# EasyEDA Pro project ProPrj_control-acceso-rfid_2025-05-21.epro

# Schematic Schematic1
Board Name: Board1; Create Date: 2025-05-10; Page Name: P1; Project Name: PUERTA; Schematic Name: Schematic1; Update Date: 2025-05-12; Company: EasyEDA.com; Page Size: A4; Version: V1.0
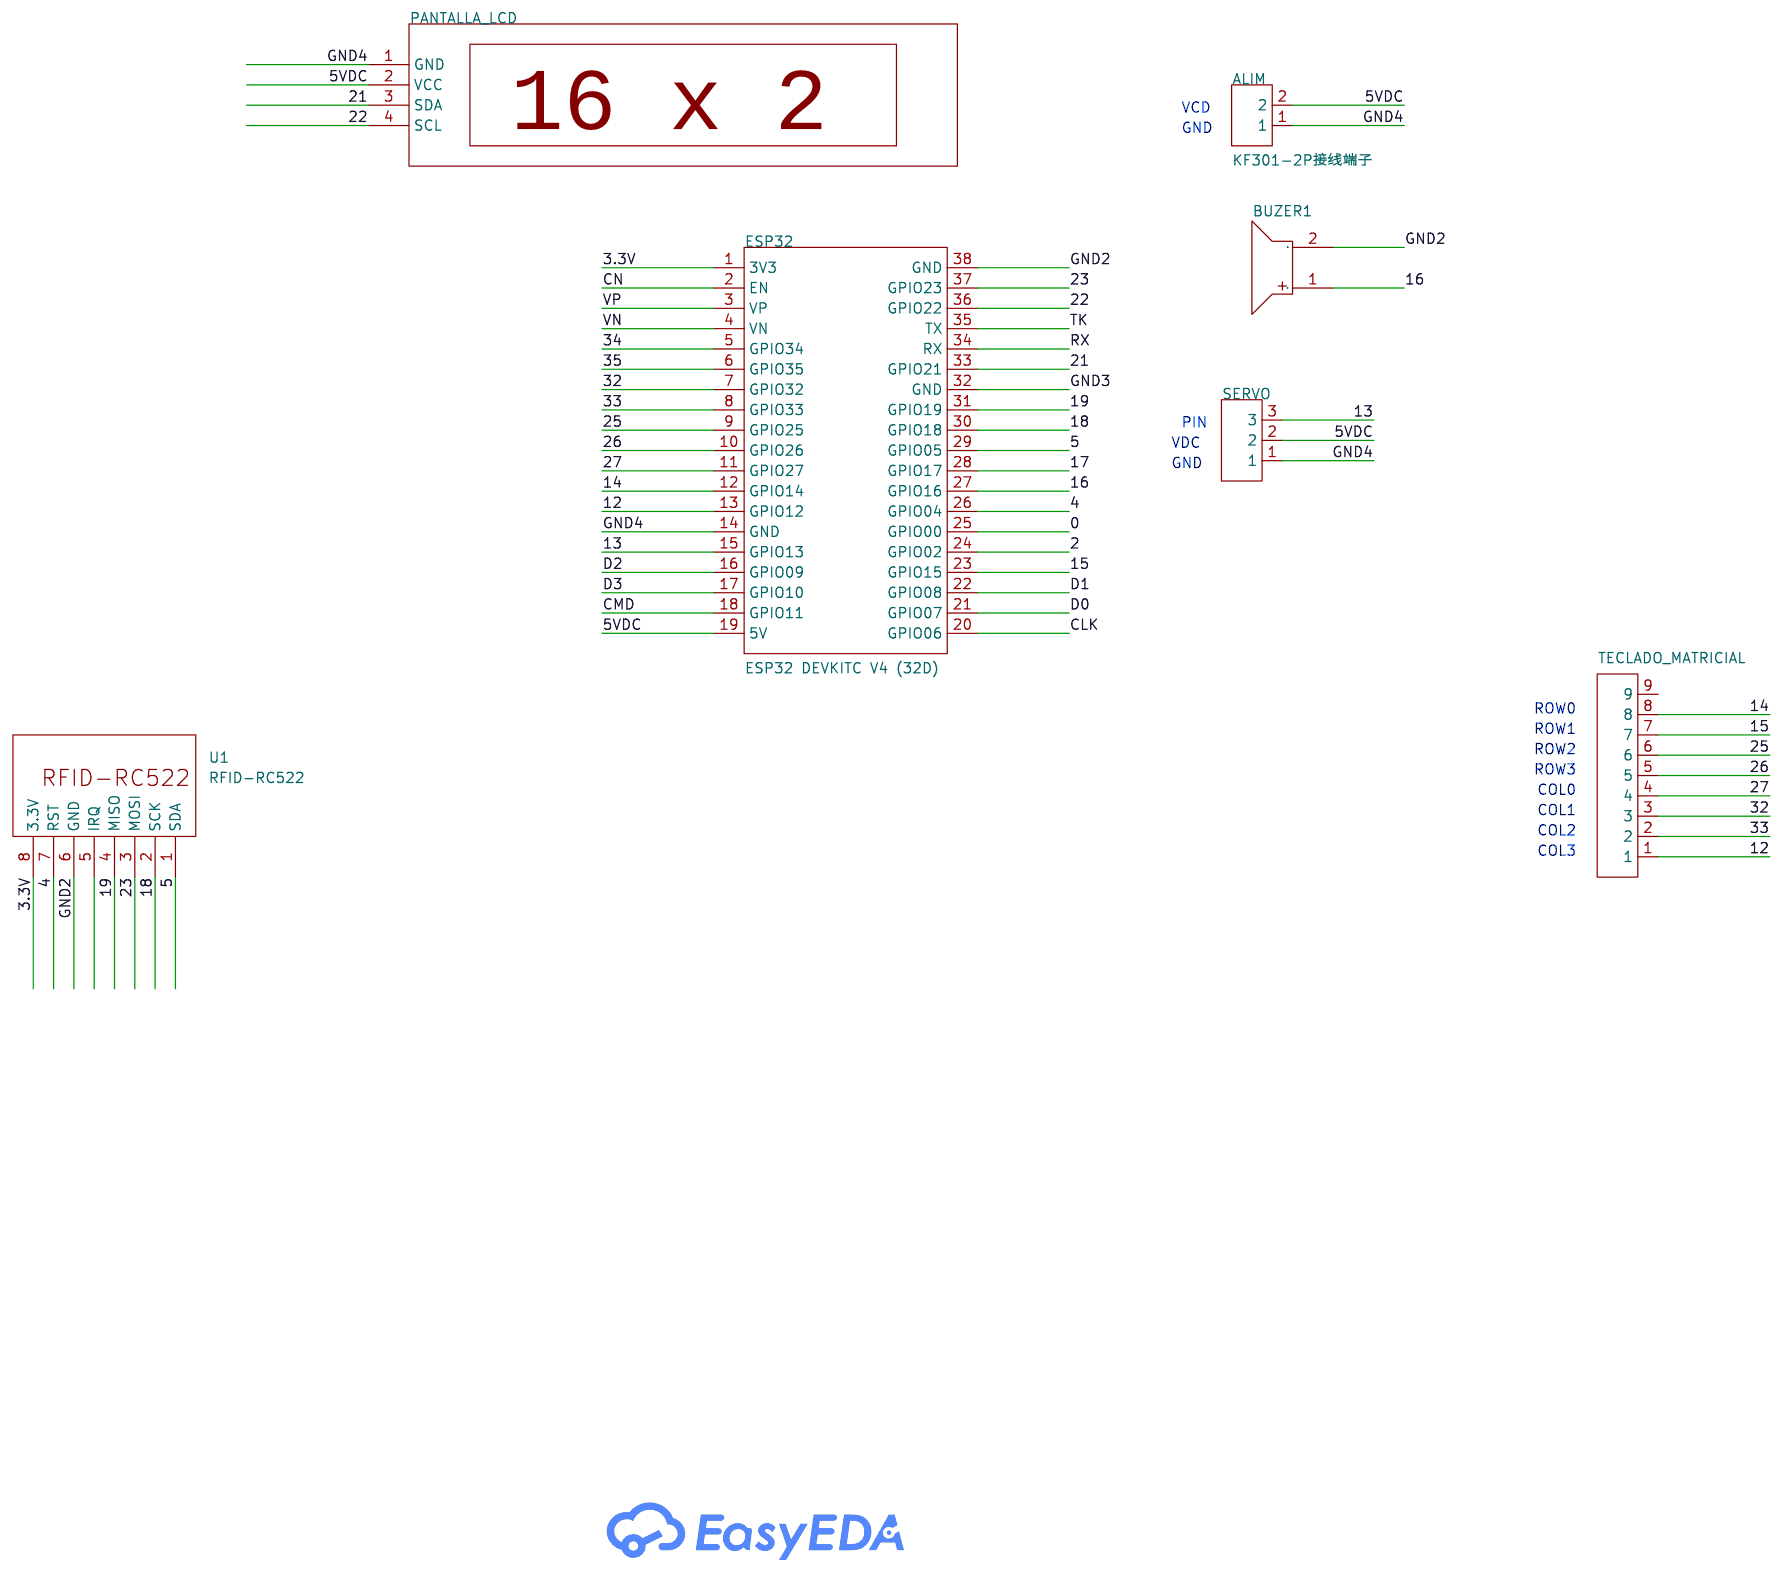
[diagram p0: schematic sheet]

## Parts
ALIM  KF301-2P接线端子  [CONN-TH_XY301V-A-5.0-2P]
BUZER1  CUI_CST-931AP  [BUZ-TH_BD9.0-P4.00-D0.6-L-FD]
ESP32  ESP32 DEVKITC V4 (32D)  [ESP32_DEVKITC_V4 (32D) BOARD]
PANTALLA_LCD  -  [LCD1602+I2C EDITADO]
SERVO  -  [HDR-TH_3P-P2.54-V-M]
TECLADO_MATRICIAL  -  [HDR-TH_9P-P2.54-V-M]
U1  RFID-RC522  [RFID-RC522-FAKHRI]

## Library data of the parts
ALIM = KF301-2P接线端子: Supplier Part: C9900016950; Supplier Footprint: CK301-2P; JLCPCB Part Class: Extended Part; Supplier: LCSC
BUZER1 = CUI_CST-931AP: Supplier Part: C9900006511; Supplier Footprint: BUZZERPIEZO3V30MMTH; JLCPCB Part Class: Extended Part; Supplier: LCSC
ESP32 = ESP32 DEVKITC V4 (32D): Manufacturer: Espressif
PANTALLA_LCD = LCD1602 I2C copy: Manufacturer Part: LCD1602 I2C
SERVO = HDR-M_2.54_1x3P: Supplier Footprint: Through
TECLADO_MATRICIAL = HDR-M_2.54-1x9P: Supplier Footprint: Through
U1 = RFID-RC522

## Nets
3.3V: ESP32.1(3V3) U1.8(3.3V)
5VDC: ALIM.2 ESP32.19(5V) PANTALLA_LCD.2(VCC) SERVO.2
GND2: BUZER1.2 ESP32.38(GND) U1.6(GND)
GND3: ESP32.32(GND)
GND4: ALIM.1 ESP32.14(GND) PANTALLA_LCD.1(GND) SERVO.1
0: ESP32.25(GPIO00)
2: ESP32.24(GPIO02)
4: ESP32.26(GPIO04) U1.7(RST)
5: ESP32.29(GPIO05) U1.1(SDA)
12: ESP32.13(GPIO12) TECLADO_MATRICIAL.1
13: ESP32.15(GPIO13) SERVO.3
14: ESP32.12(GPIO14) TECLADO_MATRICIAL.8
15: ESP32.23(GPIO15) TECLADO_MATRICIAL.7
16: BUZER1.1 ESP32.27(GPIO16)
17: ESP32.28(GPIO17)
18: ESP32.30(GPIO18) U1.2(SCK)
19: ESP32.31(GPIO19) U1.4(MISO)
21: ESP32.33(GPIO21) PANTALLA_LCD.3(SDA)
22: ESP32.36(GPIO22) PANTALLA_LCD.4(SCL)
23: ESP32.37(GPIO23) U1.3(MOSI)
25: ESP32.9(GPIO25) TECLADO_MATRICIAL.6
26: ESP32.10(GPIO26) TECLADO_MATRICIAL.5
27: ESP32.11(GPIO27) TECLADO_MATRICIAL.4
32: ESP32.7(GPIO32) TECLADO_MATRICIAL.3
33: ESP32.8(GPIO33) TECLADO_MATRICIAL.2
34: ESP32.5(GPIO34)
35: ESP32.6(GPIO35)
CLK: ESP32.20(GPIO06)
CMD: ESP32.18(GPIO11)
CN: ESP32.2(EN)
D0: ESP32.21(GPIO07)
D1: ESP32.22(GPIO08)
D2: ESP32.16(GPIO09)
D3: ESP32.17(GPIO10)
RX: ESP32.34(RX)
TK: ESP32.35(TX)
VN: ESP32.4(VN)
VP: ESP32.3(VP)

Not connected (* = marked no-connect by the designer): TECLADO_MATRICIAL 9; U1 5(IRQ)

## Notes on the sheet
- VCD
- GND
- PIN
- VDC
- GND
- ROW0
- ROW1
- ROW2
- ROW3
- COL0
- COL1
- COL2
- COL3

# Board PCB1
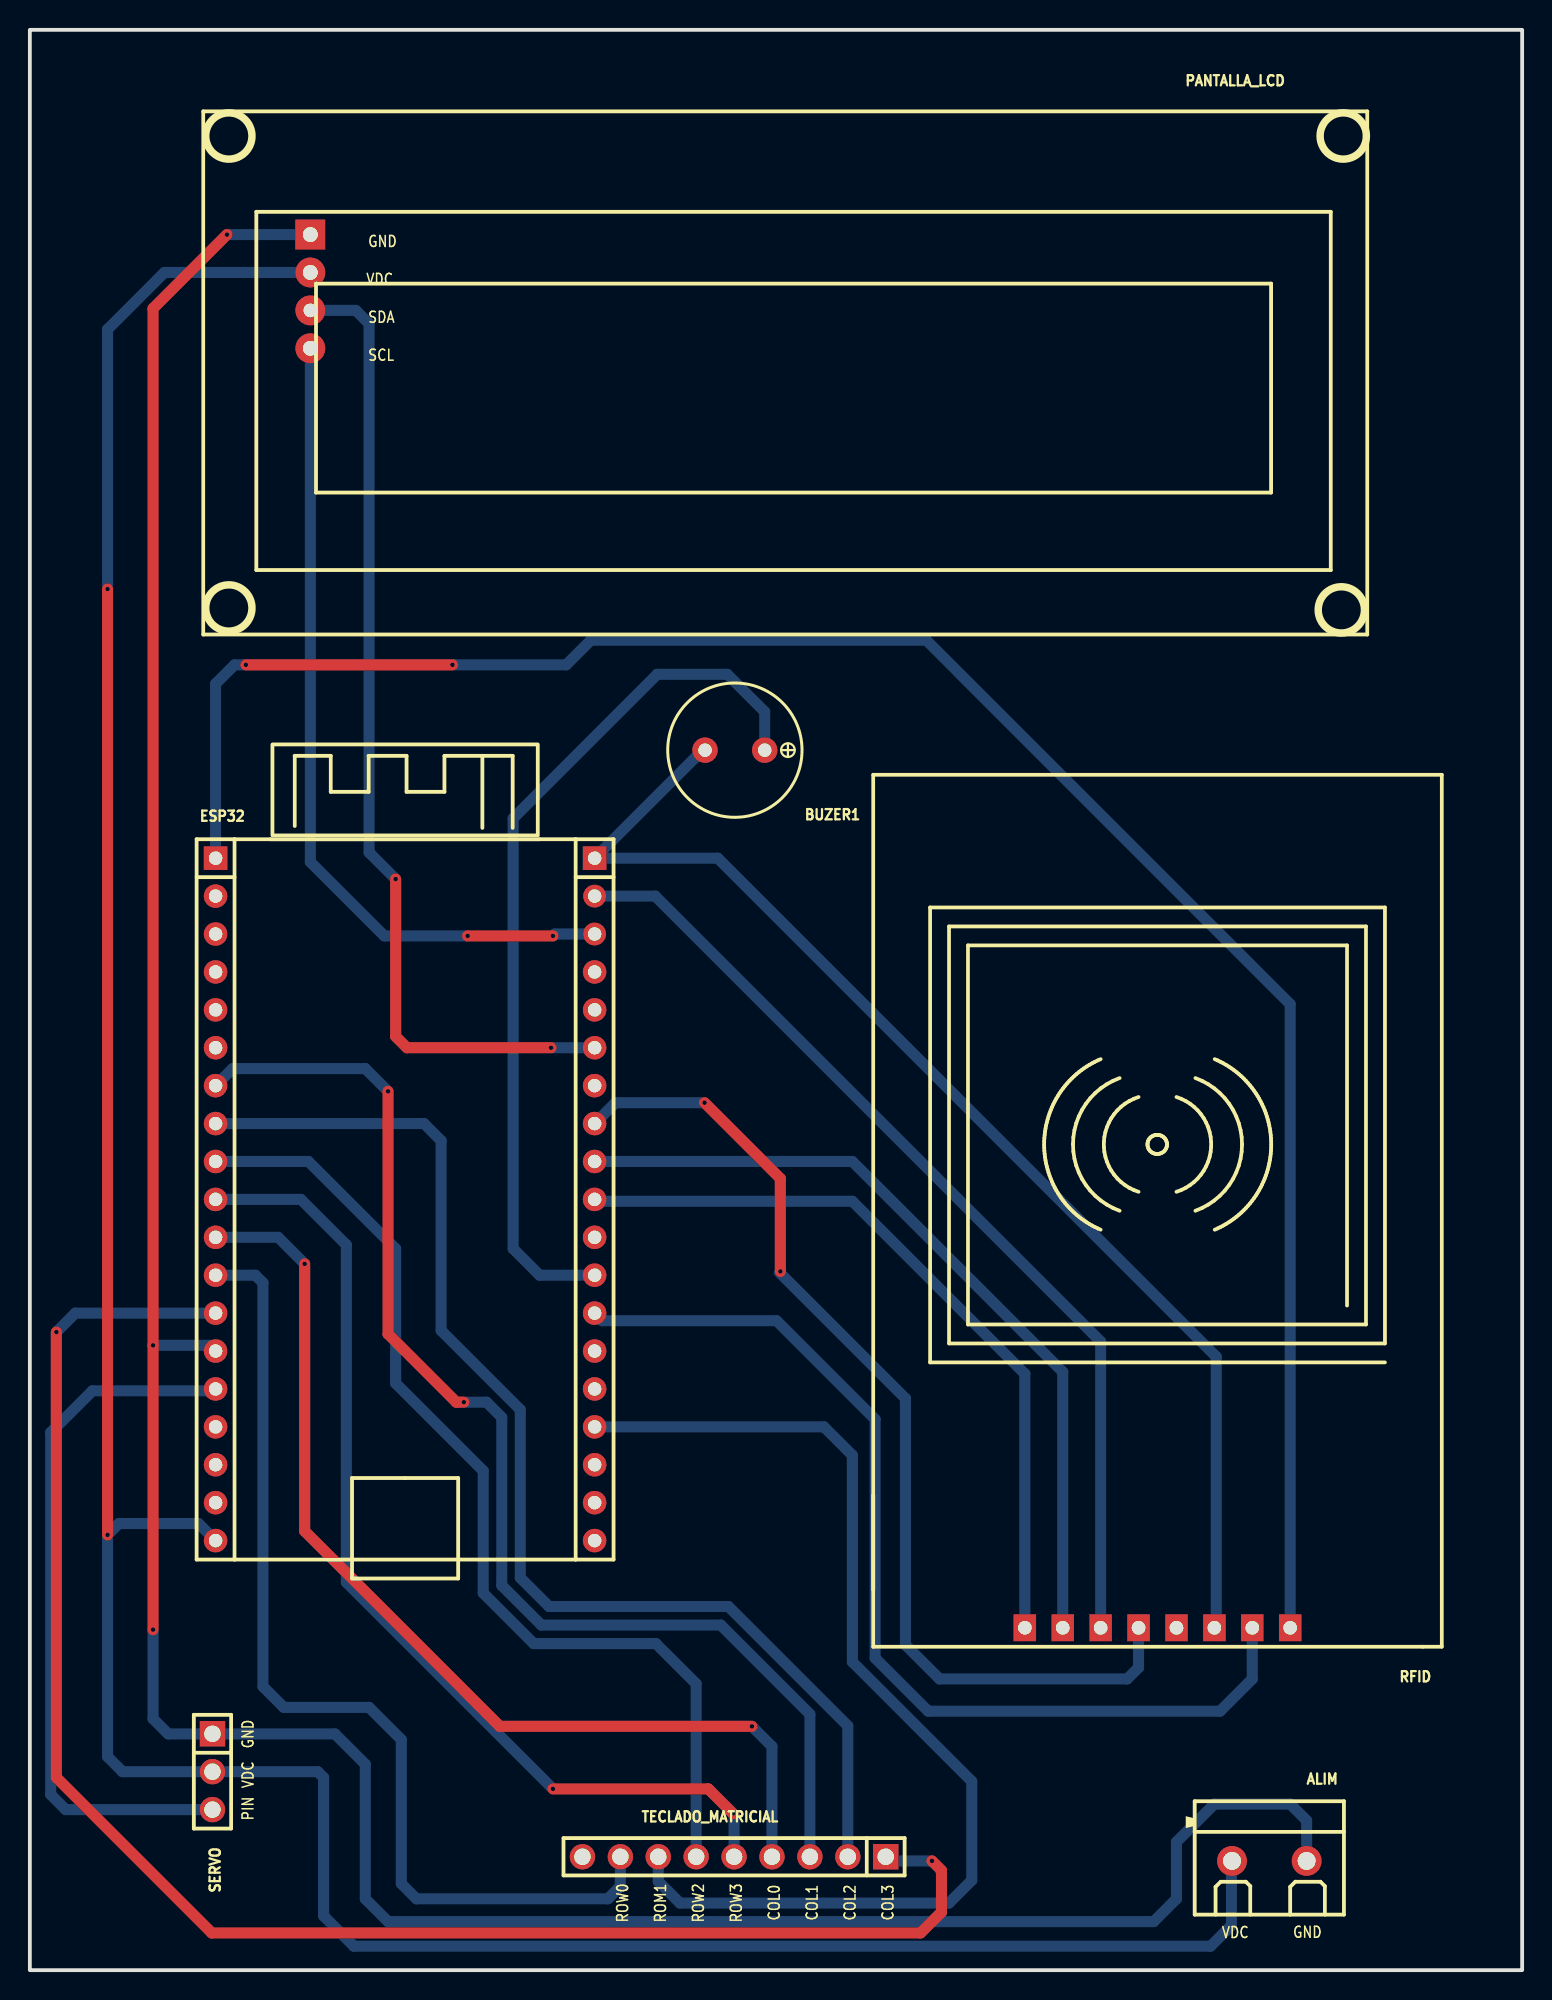
[diagram p1: board, top side]
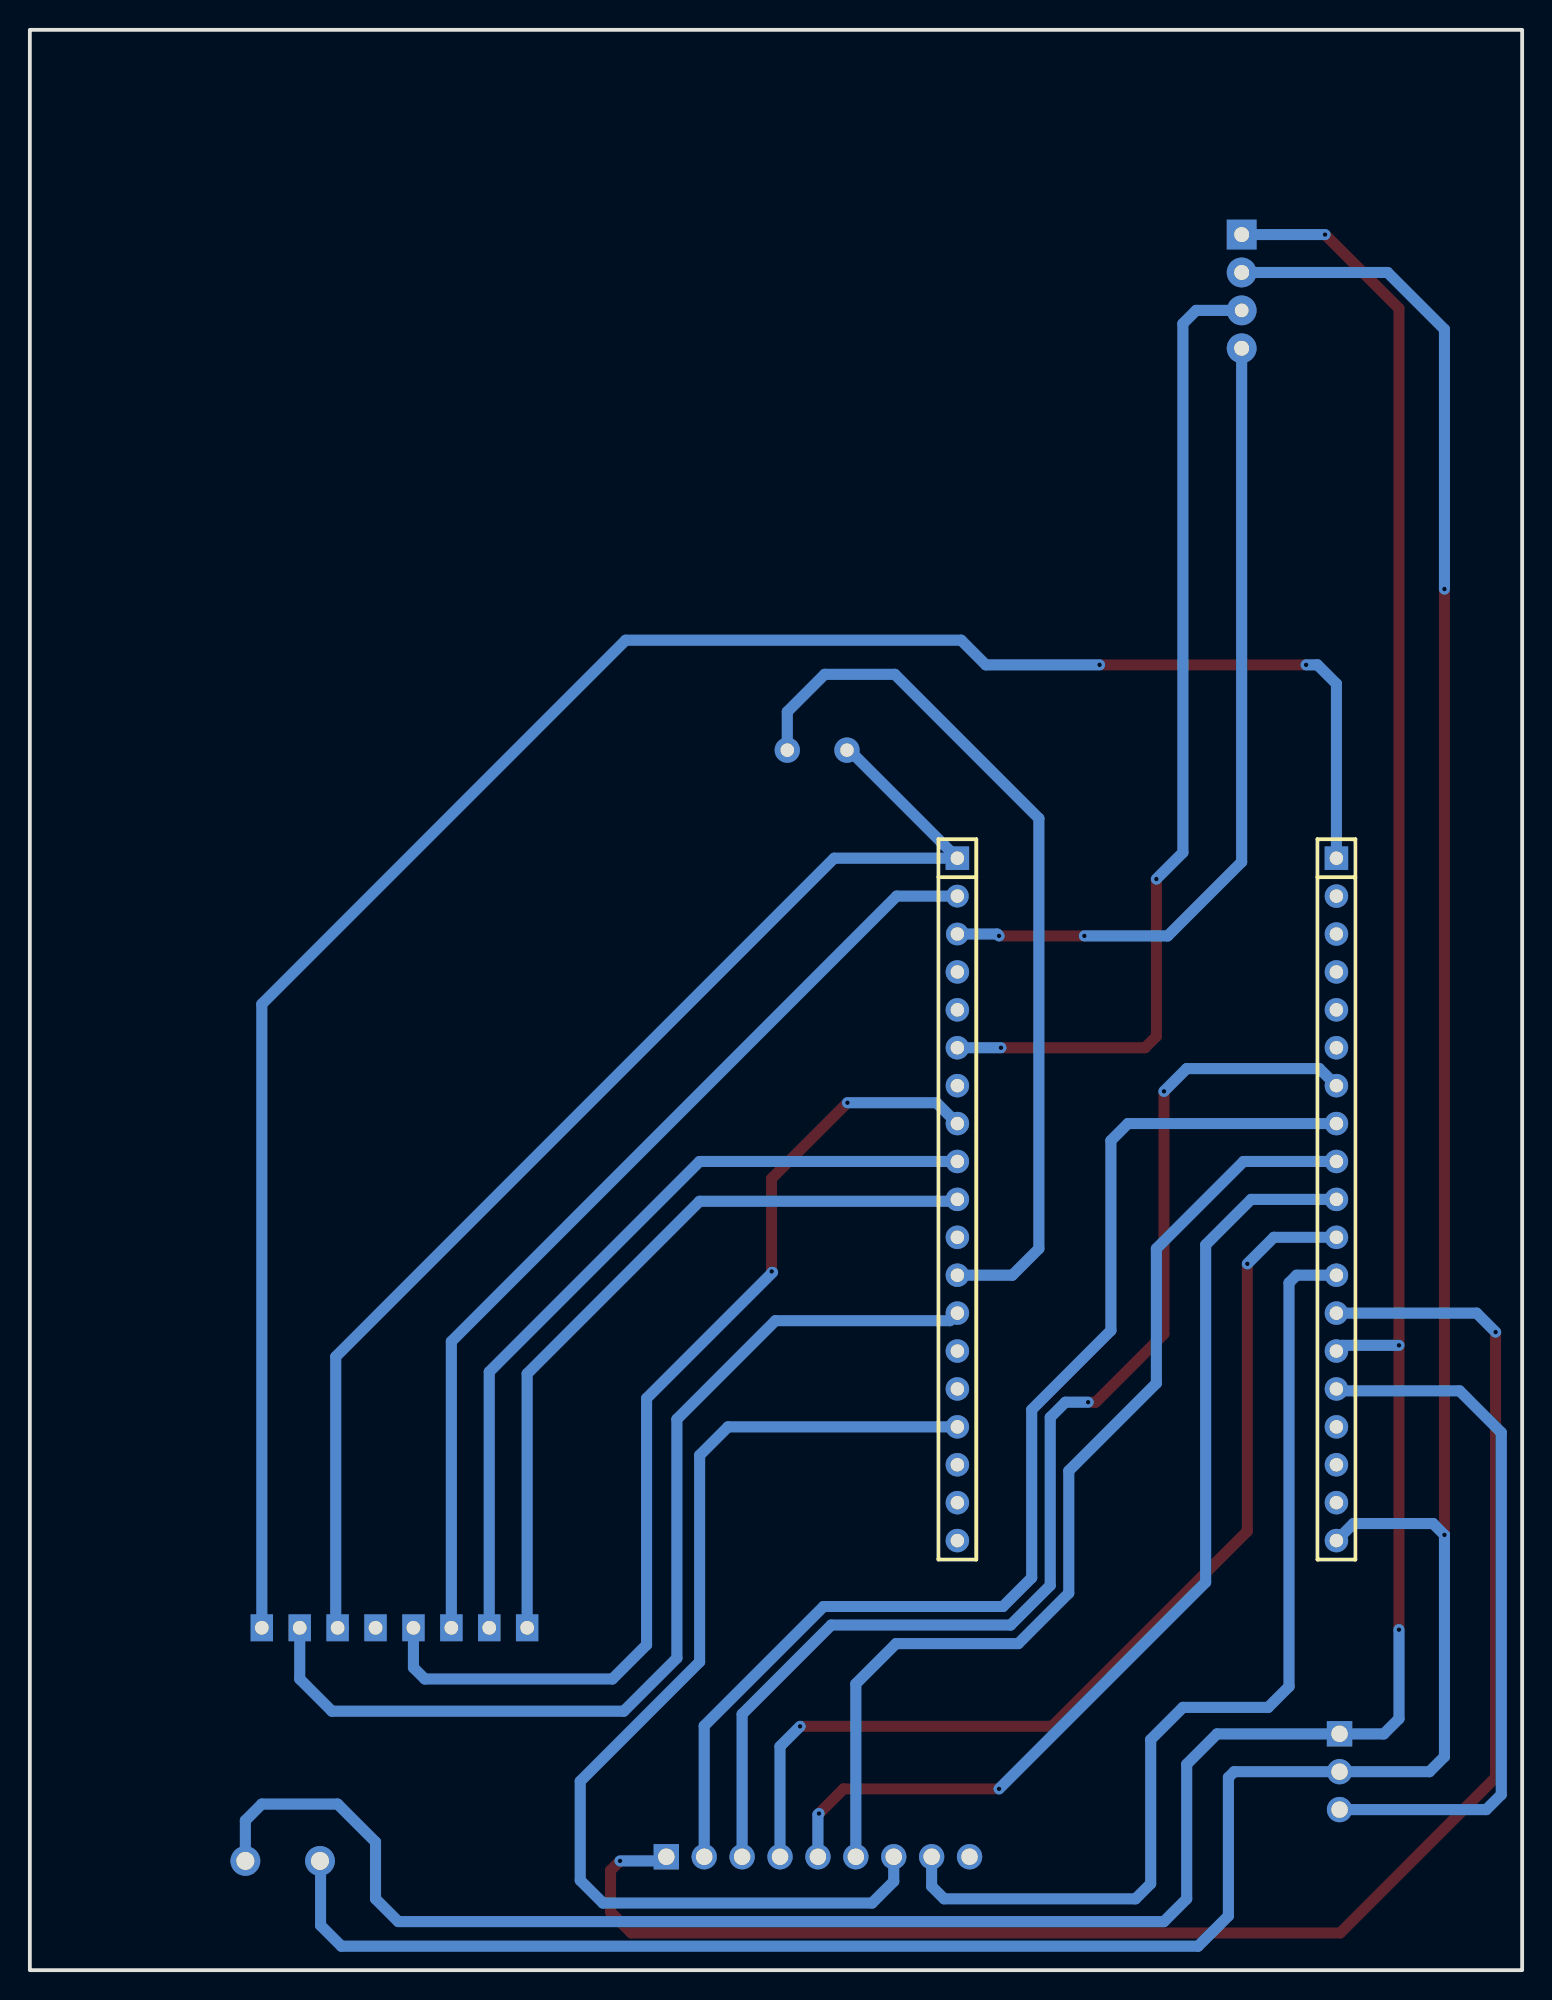
[diagram p2: board, bottom side, seen from below]

Outline 100 x 130 mm; copper layers: Top Layer, Bottom Layer. Coordinates in mm from the lower left corner of the outline.
Outline path: rectangle 0,130 100,0
Stack: Top Layer 0.035mm / Dielectric1 1.51mm FR4 er 4.5 / Bottom Layer 0.035mm

## Design rules (mm)
template: Custom Config
spacing copperThickness1oz (default): track to track 0.502, other pairs 0.152 to 0.3
spacing copperThickness2oz: track to track 0.203, other pairs 0.152 to 0.3
track width copperThickness1oz (default): min 0.127, default 0.254, max 2.54
track width copperThickness2oz: min 0.203, default 0.254, max 2.54
differential pair differentialPair (default): width min 0.127, default 0.254, max 2.54; gap min 0.152, default 0.152
via viaSize (default): diameter min 0.5, default 0.61, max 10; hole min 0.3, default 0.305, max 6.3

## Placement (name value [footprint] x y rotation side)
ALIM  KF301-2P接线端子  [CONN-TH_XY301V-A-5.0-2P]  83.06 7.32 180 top
BUZER1  CUI_CST-931AP  [BUZ-TH_BD9.0-P4.00-D0.6-L-FD]  47.24 81.74 180 top
ESP32  ESP32 DEVKITC V4 (32D)  [ESP32_DEVKITC_V4 (32D) BOARD]  25.15 51.64 0 top
PANTALLA_LCD  -  [LCD1602+I2C EDITADO]  18.8 112.47 0 top
RFID  RFID-RC522  [RFID-RC522-FAKHRI]  75.57 50.88 180 top
SERVO  -  [HDR-TH_3P-P2.54-V-M]  12.24 13.3 270 top
TECLADO_MATRICIAL  -  [HDR-TH_9P-P2.54-V-M]  47.19 7.6 180 top

## Footprints (pads in the part's own frame, mm; a bottom-side part is the same pattern mirrored in y, then rotated)
BUZ-TH_BD9.0-P4.00-D0.6-L-FD
  round 1.7 hole 0.9: 1(-2,0) 2(2,0)
CONN-TH_XY301V-A-5.0-2P
  round 2 hole 1.2: 1(-2.5,0) 2(2.5,0)
ESP32_DEVKITC_V4 (32D) BOARD
  rect 1.575x1.575 hole 0.9: 1(-12.7,22.86) 38(12.7,22.86)
  round 1.575 hole 0.9: 2(-12.7,20.32) 3(-12.7,17.78) 4(-12.7,15.24) 5(-12.7,12.7) 6(-12.7,10.16) 7(-12.7,7.62) 8(-12.7,5.08) 9(-12.7,2.54) 10(-12.7,0) 11(-12.7,-2.54) 12(-12.7,-5.08) 13(-12.7,-7.62) 14(-12.7,-10.16) 15(-12.7,-12.7) 16(-12.7,-15.24) 17(-12.7,-17.78) 18(-12.7,-20.32) 19(-12.7,-22.86) 20(12.7,-22.86) 21(12.7,-20.32) 22(12.7,-17.78) 23(12.7,-15.24) 24(12.7,-12.7) 25(12.7,-10.16) 26(12.7,-7.62) 27(12.7,-5.08) 28(12.7,-2.54) 29(12.7,0) 30(12.7,2.54) 31(12.7,5.08) 32(12.7,7.62) 33(12.7,10.16) 34(12.7,12.7) 35(12.7,15.24)
  round 1.524 hole 0.9: 36(12.7,17.78) 37(12.7,20.32)
HDR-TH_3P-P2.54-V-M
  rect 1.7x1.7 hole 1.1: 1(-2.54,0)
  round 1.7 hole 1.1: 2(0,0) 3(2.54,0)
HDR-TH_9P-P2.54-V-M
  rect 1.7x1.7 hole 1.1: 1(-10.16,0)
  round 1.7 hole 1.1: 2(-7.62,0) 3(-5.08,0) 4(-2.54,0) 5(0,0) 6(2.54,0) 7(5.08,0) 8(7.62,0) 9(10.16,0)
LCD1602+I2C EDITADO
  rect 2x2 hole 1: 1(0,3.81)
  round 2 hole 1: 2(0,1.27) 4(0,-3.81)
  round 2 hole 0.914: 3(0,-1.27)
RFID-RC522-FAKHRI
  rect 1.5x1.8 hole 0.914: 1(8.889,27.941) 2(6.349,27.941) 3(3.809,27.941) 4(1.27,27.941) 5(-1.27,27.941) 6(-3.811,27.941) 7(-6.351,27.941) 8(-8.89,27.941)

## Nets
As in the schematic, except:
3.3V: ESP32.1 RFID.8
GND2: BUZER1.2 ESP32.38 RFID.6
4: ESP32.26 RFID.7
5: ESP32.29 RFID.1
18: ESP32.30 RFID.2
19: ESP32.31 RFID.4
23: ESP32.37 RFID.3

Pads without a net: TECLADO_MATRICIAL 9

## Via types
v1: diameter 0.61, hole 0.305, Top Layer to Bottom Layer, 21 vias

## Routing (per net, layer and track width the routed paths; a pad name or vN(x,y) marks a point on that pad's centre or on a via; arc(x,y) is an arc through that point)
3.3V: length 136.8
  Top Layer w0.74: v1(14.48,87.45) v1(28.32,87.45)
  Bottom Layer w0.74: ESP32.1 12.45,86.18 13.72,87.45 v1(14.48,87.45) ; RFID.8 84.46,64.72 60.07,89.11 37.59,89.11 35.94,87.45 v1(28.32,87.45)
5VDC: length 209.7
  Top Layer w0.74: v1(5.21,29.16) v1(5.21,92.53)
  Bottom Layer w0.74: v1(5.21,92.53) 5.21,109.93 9.02,113.74 PANTALLA_LCD.2 ; ALIM.2 80.52,7.28 80.52,3 79.12,1.6 21.72,1.6 19.69,3.63 19.69,12.91 19.29,13.3 SERVO.2 6.21,13.3 5.21,14.3 v1(5.21,29.16) 5.97,29.92 11.3,29.92 ESP32.19
GND2: length 84.3
  Bottom Layer w0.74: 78.98,22.94 79.5,23.46 79.5,41.1 46.1,74.5 ESP32.38 45.08,81.74 BUZER1.2
GND4: length 208.3
  Top Layer w0.74: v1(13.21,116.28) 8.26,111.33 v1(8.26,41.86) v1(8.26,22.81)
  Bottom Layer w0.74: ALIM.1 85.56,10.03 84.45,11.13 79.38,11.13 76.83,8.59 76.83,4.78 75.31,3.25 24,3.25 22.48,4.78 22.48,13.79 20.45,15.83 12.25,15.83 SERVO.1 12.23,15.83 9.27,15.83 8.26,16.84 v1(8.26,22.81) ; v1(13.21,116.28) PANTALLA_LCD.1 ; ESP32.14 12.06,41.86 v1(8.26,41.86)
4: length 68.8
  Bottom Layer w0.74: RFID.7 81.92,19.51 79.76,17.35 60.2,17.35 56.64,20.91 56.64,36.91 50.04,43.51 38.35,43.51 ESP32.26
5: length 50.7
  Bottom Layer w0.74: RFID.1 66.68,39.96 55.12,51.51 37.97,51.51 ESP32.29
12: length 112.1
  Top Layer w0.74: v1(60.45,7.32) 61.09,6.68 61.09,3.89 59.69,2.49 12.19,2.49 1.78,12.91 v1(1.78,42.75)
  Bottom Layer w0.74: TECLADO_MATRICIAL.1 57.63,7.32 v1(60.45,7.32) ; v1(1.78,42.75) 3.05,44.02 ESP32.13
13: length 47.8
  Bottom Layer w0.74: ESP32.15 12.32,38.81 4.19,38.81 1.4,36.02 1.4,11.76 2.4,10.76 SERVO.3
14: length 68.3
  Bottom Layer w0.74: TECLADO_MATRICIAL.8 39.57,5.61 38.73,4.78 25.91,4.78 24.89,5.79 24.89,15.45 22.73,17.6 17.02,17.6 15.62,19 15.62,46.05 15.11,46.56 ESP32.12
15: length 73.7
  Bottom Layer w0.74: ESP32.23 53.21,36.4 55.12,34.5 55.12,20.65 63.12,12.65 63.12,6.02 61.6,4.5 43.56,4.5 42.11,5.95 TECLADO_MATRICIAL.7
16: length 59.5
  Bottom Layer w0.74: BUZER1.1 49.24,84.31 46.74,86.82 42.04,86.82 32.39,77.17 32.39,48.34 34.16,46.56 ESP32.27
18: length 54.4
  Bottom Layer w0.74: ESP32.30 55.12,54.18 69.22,40.08 RFID.2
19: length 69.4
  Top Layer w0.74: v1(45.21,58.12) 50.29,53.04 v1(50.29,46.81)
  Bottom Layer w0.74: RFID.4 74.3,20.27 73.53,19.51 60.96,19.51 58.67,21.8 58.67,38.31 50.23,46.75 ; ESP32.31 39.24,58.12 v1(45.21,58.12)
21: length 66.4
  Top Layer w0.74: v1(24.51,73.1) 24.51,62.56 25.27,61.8 v1(34.92,61.8)
  Bottom Layer w0.74: v1(34.92,61.8) ESP32.33 ; PANTALLA_LCD.3 21.84,111.2 22.73,110.31 22.73,74.88 v1(24.51,73.1)
22: length 55.6
  Top Layer w0.74: v1(29.34,69.29) v1(35.05,69.29)
  Bottom Layer w0.74: v1(29.34,69.29) 23.75,69.29 18.8,74.25 PANTALLA_LCD.4 ; v1(35.05,69.29) 35.18,69.42 ESP32.36
23: length 65.4
  Bottom Layer w0.74: ESP32.37 41.91,71.96 71.76,42.12 RFID.3
25: length 68.4
  Bottom Layer w0.74: ESP32.9 18.67,54.18 24.51,48.34 24.51,39.32 30.38,33.45 30.38,25.26 33.76,21.88 41.95,21.88 44.65,19.18 TECLADO_MATRICIAL.6
26: length 67.9
  Top Layer w0.74: v1(47.12,10.49) 45.47,12.14 v1(35.05,12.14)
  Bottom Layer w0.74: TECLADO_MATRICIAL.5 47.19,10.42 v1(47.12,10.49) ; v1(35.05,12.14) 21.21,25.99 21.21,48.59 18.16,51.64 ESP32.10
27: length 69.3
  Top Layer w0.74: v1(48.39,16.33) 31.5,16.33 18.42,29.42 v1(18.42,47.32)
  Bottom Layer w0.74: v1(18.42,47.32) 16.64,49.1 ESP32.11 ; v1(48.39,16.33) 49.73,14.99 TECLADO_MATRICIAL.4
32: length 83.9
  Top Layer w0.74: v1(29.08,38.05) 28.58,38.05 24,42.62 v1(24,58.88)
  Bottom Layer w0.74: v1(29.08,38.05) 30.61,38.05 31.62,37.04 31.62,25.78 34.28,23.12 46.3,23.12 52.27,17.15 TECLADO_MATRICIAL.3 ; v1(24,58.88) 22.48,60.4 13.59,60.4 ESP32.7
33: length 81.9
  Bottom Layer w0.74: ESP32.8 26.42,56.72 27.56,55.58 27.56,42.86 32.86,37.55 32.86,26.29 34.79,24.36 46.81,24.36 54.81,16.37 TECLADO_MATRICIAL.2

## Text on the board
Top Silkscreen Layer: VDC | GND | SDA | SCL | ROW0 | ROM1 | ROW2 | ROW3 | COL0 | COL1 | COL2 | COL3 | PIN
